# Altium schematic sheet 02.SchDoc
size 297 x 209 mm
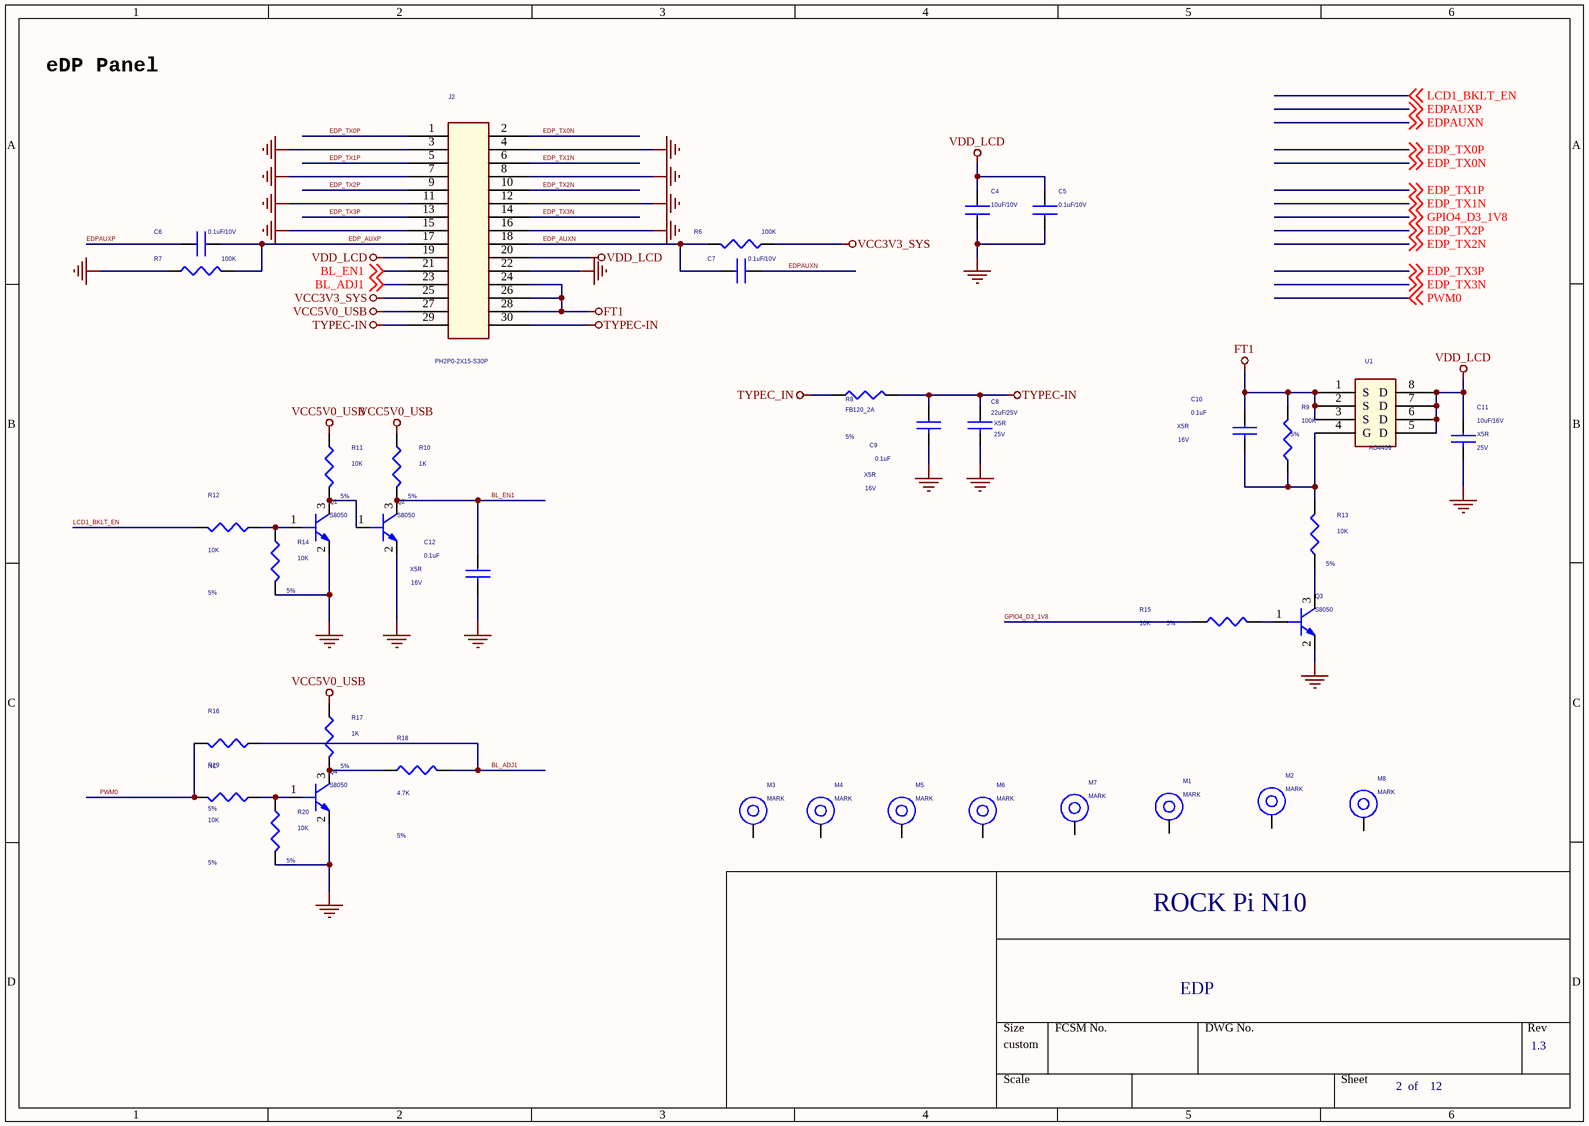
[diagram p0: 02.SchDoc]

## Parts
C4  10uF/10V  [C0603]
C5  0.1uF/10V  [C0603]
C6  0.1uF/10V  [C0603]
C7  0.1uF/10V  [C0603]
C8  22uF/25V  Dielectric: X5R  Voltage: 25V  [C0805]
C9  0.1uF  Dielectric: X5R  Voltage: 16V  [C0402]
C10  0.1uF  Dielectric: X5R  Voltage: 16V  [C0402]
C11  10uF/16V  Dielectric: X5R  Voltage: 25V  [C0805]
C12  0.1uF  Dielectric: X5R  Voltage: 16V  [C0402]
J2  PH2P0-2X15-S30P  [PH2P0-2X15-S30P]
M1  MARK  [MARK]
M2  MARK  [MARK]
M3  MARK  [MARK]
M4  MARK  [MARK]
M5  MARK  [MARK]
M6  MARK  [MARK]
M7  MARK  [MARK]
M8  MARK  [MARK]
Q1  S8050  [SOT_23]
Q2  S8050  [SOT_23]
Q3  S8050  [SOT23]
Q4  S8050  [SOT_23]
R6  100K  [R0402]
R7  100K  [R0402]
R8  FB120_2A  Tolerance: 5%  [R0402]
R9  100K  Tolerance: 5%  [R0402]
R10  1K  Tolerance: 5%  [R0402]
R11  10K  Tolerance: 5%  [R0402]
R12  10K  Tolerance: 5%  [R0402]
R13  10K  Tolerance: 5%  [R0402]
R14  10K  Tolerance: 5%  [R0402]
R15  10K  Tolerance: 5%  [R0402]
R16  NC  Tolerance: 5%  [R0402]
R17  1K  Tolerance: 5%  [R0402]
R18  4.7K  Tolerance: 5%  [R0402]
R19  10K  Tolerance: 5%  [R0402]
R20  10K  Tolerance: 5%  [R0402]
U1  AO4409  [SOP8-50-150]

## Nets
FT1: C10.1 J2.24 J2.26 J2.28 R9.1 U1.1(S) U1.2(S) U1.3(S)
GND: C4.2 C5.2 C8.2 C9.2 C11.2 C12.2 J2.3 J2.4 J2.7 J2.8 J2.11 J2.12 J2.15 J2.16 J2.22 Q1.2(EMITTER) Q2.2(EMITTER) Q3.2(EMITTER) Q4.2(EMITTER) R7.2 R14.1 R20.1
TYPEC-IN: C8.1 C9.1 J2.29 J2.30 R8.2
TYPEC_IN: R8.1
VCC3V3_SYS: J2.25 R6.2
VCC5V0_USB: J2.27 R10.2 R11.2 R17.2
VDD_LCD: C4.1 C5.1 C11.1 J2.19 J2.20 U1.5(D) U1.6(D) U1.7(D) U1.8(D)
BL_ADJ1: J2.23 R16.2 R18.1 ; off-sheet BL_ADJ1
BL_EN1: C12.1 J2.21 Q2.3(COLLECTOR) R10.1 ; off-sheet BL_EN1
EDP_AUXN: C7.2 J2.18 R6.1
EDP_AUXP: C6.2 J2.17 R7.1
EDP_TX0N: J2.2 ; off-sheet EDP_TX0N
EDP_TX0P: J2.1 ; off-sheet EDP_TX0P
EDP_TX1N: J2.6 ; off-sheet EDP_TX1N
EDP_TX1P: J2.5 ; off-sheet EDP_TX1P
EDP_TX2N: J2.10 ; off-sheet EDP_TX2N
EDP_TX2P: J2.9 ; off-sheet EDP_TX2P
EDP_TX3N: J2.14 ; off-sheet EDP_TX3N
EDP_TX3P: J2.13 ; off-sheet EDP_TX3P
EDPAUXN: C7.1 ; off-sheet EDPAUXN
EDPAUXP: C6.1 ; off-sheet EDPAUXP
GPIO4_D3_1V8: R15.1 ; off-sheet GPIO4_D3_1V8
LCD1_BKLT_EN: R12.1 ; off-sheet LCD1_BKLT_EN
PWM0: R16.1 R19.1 ; off-sheet PWM0
NetC10_2: C10.2 R9.2 R13.1 U1.4(G)
NetQ1_1: Q1.1(BASE) R12.2 R14.2
NetQ1_3: Q1.3(COLLECTOR) Q2.1(BASE) R11.1
NetQ3_1: Q3.1(BASE) R15.2
NetQ3_3: Q3.3(COLLECTOR) R13.2
NetQ4_1: Q4.1(BASE) R19.2 R20.2
NetQ4_3: Q4.3(COLLECTOR) R17.1 R18.2

Not connected (* = marked no-connect by the designer): M1 1; M2 1; M3 1; M4 1; M5 1; M6 1; M7 1; M8 1

## Notes on the sheet
- eDP Panel
- ROCK Pi N10
- EDP
- 1.3
- 2  of    12

## Library data of the parts
C4 = CAP NP_Dup4: CAP,MLCC,4.7uF,+/-10%,X5R,6.3V,SMD0603
C5-C7 = CAP NP_Dup4: CAP,MLCC,100nF,+/-10%,X7R,6.3V,SMD0402
C8 = CAP NP_2: cap,4.70uF,+/-10%,6.3V,X5R,C0603; Manufacturer PN: C1608X5R0J475K080AB; Manufacturer: TDK; Tolerance: 10%; Priority: A; Created by: JJJ; Part Type: C0603; RK PN: C1608X5R0J475K080AB
C9 C12 = CAP NP_2: cap,100.00nF,+/-10%,6.3V,X5R,C0402; Manufacturer PN: C1005X5R0J104K050BA; Manufacturer: TDK; Tolerance: 10%; Priority: A; Created by: JJJ; Part Type: C0402; RK PN: C1005X5R0J104K050BA
C10 = CAP NP_2: cap,100.00nF,+/-10%,6.3V,X5R,C0402; Manufacturer: TDK; RK PN: C1005X5R0J104K050BA; Priority: A; Tolerance: 10%; Part Type: C0402; Manufacturer PN: C1005X5R0J104K050BA; Created by: JJJ
C11 = CAP NP_2: cap,4.70uF,+/-10%,6.3V,X5R,C0603; Manufacturer: TDK; RK PN: C1608X5R0J475K080AB; Priority: A; Tolerance: 10%; Part Type: C0603; Manufacturer PN: C1608X5R0J475K080AB; Created by: JJJ
J2 = CON20A_2
M1 M2 M4-M8 = MARK: MARK Symble; RK PN: MARK01; Priority: A; Part Type: MARK; Created by: CZD
M3 = MARK: MARK Symble; Priority: A; RK PN: MARK01; Created by: CZD; Part Type: MARK
Q1 Q2 = NPN: S8050 SOT23; Manufacturer: 长电; Manufacturer PN: S8050_SOT23; Priority: A; Ic: 0.5A; Vceo: 25V; Pc: 0.3W; RK PN: S8050; Part Type: NPN; Created by: JJJ
Q3 Q4 = NPN: S8050 SOT23; Manufacturer PN: S8050_SOT23; Manufacturer: 长电; Pc: 0.3W; Vceo: 25V; Ic: 0.5A; Priority: A; Created by: JJJ; Part Type: NPN; RK PN: S8050
R6 R7 = RESISTOR_1_Dup1
R8 R10 R13 R19 R20 = RESISTOR_3: 通用厚膜电阻,10K,+/-5%,R0402,1/16W.; Manufacturer PN: RC0402JR-0710KL; Manufacturer: YAGEO; Wattage: 1/16W; Priority: A; Created by: YTL; RK PN: RC0402JR-0710KL
  R8: Part Type: R0603
  R10 R13 R19 R20: Part Type: 通用厚膜电阻
R9 = RESISTOR_3: 通用厚膜电阻,100K,+/-5%,R0402,1/16W.; Manufacturer: YAGEO; RK PN: RC0402JR-07100KL; Priority: A; Wattage: 1/16W; Part Type: 通用厚膜电阻; Manufacturer PN: RC0402JR-07100KL; Created by: YTL
R11 R12 R14-R18 = RESISTOR_3: 通用厚膜电阻,10K,+/-5%,R0402,1/16W.; Manufacturer: YAGEO; RK PN: RC0402JR-0710KL; Priority: A; Wattage: 1/16W; Part Type: 通用厚膜电阻; Manufacturer PN: RC0402JR-0710KL; Created by: YTL
U1 = AO4409_0